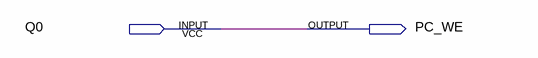
[diagram p0: schematic sheet]
// Quartus schematic PC_WE.bdf as structural Verilog: 0 symbols, 2 pins
module PC_WE (
  input  Q0,
  output PC_WE
);


  assign PC_WE = Q0;
endmodule
